# Altium schematic sheet LED.SchDoc
size A3; SheetNumber: 4; SheetTotal: 7
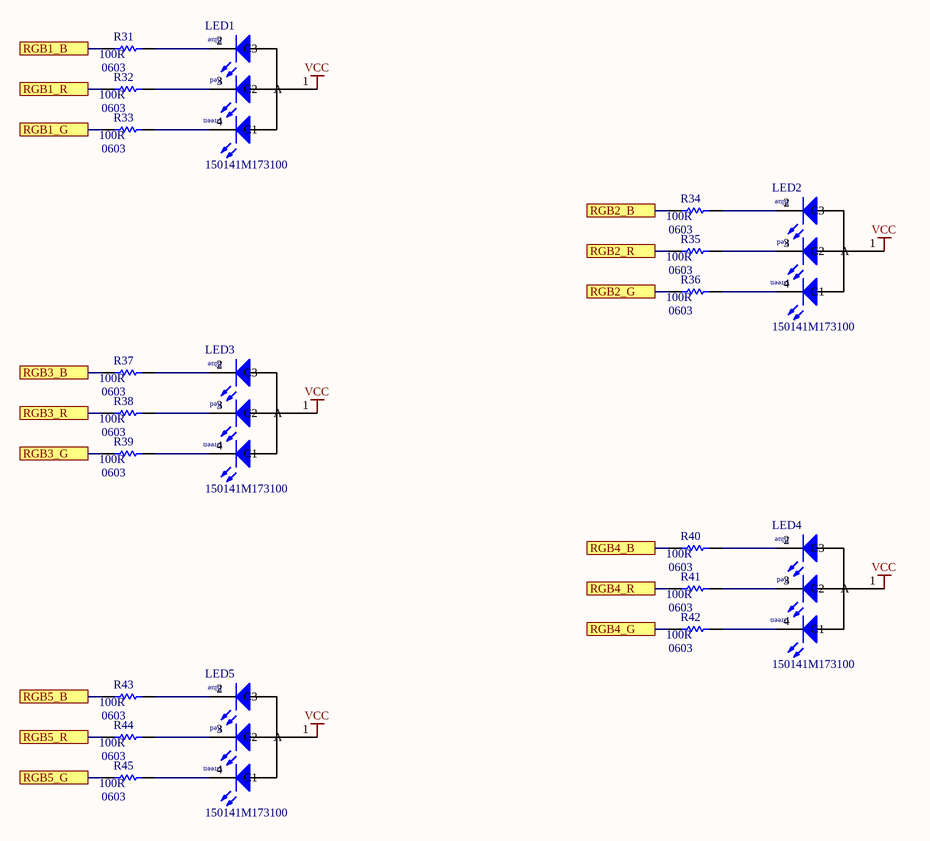
[diagram p0: LED.SchDoc]

## Parts
LED1  150141M173100  [3528_A]
LED2  150141M173100  [3528_A]
LED3  150141M173100  [3528_A]
LED4  150141M173100  [3528_A]
LED5  150141M173100  [3528_A]
R31  Case/Package: 0603  Resistance: 100R  [RESC1608X55X30LL15T15]  (hidden comment: ERJ-3EKF1000V)
R32  Case/Package: 0603  Resistance: 100R  [RESC1608X55X30LL15T15]  (hidden comment: ERJ-3EKF1000V)
R33  Case/Package: 0603  Resistance: 100R  [RESC1608X55X30LL15T15]  (hidden comment: ERJ-3EKF1000V)
R34  Case/Package: 0603  Resistance: 100R  [RESC1608X55X30LL15T15]  (hidden comment: ERJ-3EKF1000V)
R35  Case/Package: 0603  Resistance: 100R  [RESC1608X55X30LL15T15]  (hidden comment: ERJ-3EKF1000V)
R36  Case/Package: 0603  Resistance: 100R  [RESC1608X55X30LL15T15]  (hidden comment: ERJ-3EKF1000V)
R37  Case/Package: 0603  Resistance: 100R  [RESC1608X55X30LL15T15]  (hidden comment: ERJ-3EKF1000V)
R38  Case/Package: 0603  Resistance: 100R  [RESC1608X55X30LL15T15]  (hidden comment: ERJ-3EKF1000V)
R39  Case/Package: 0603  Resistance: 100R  [RESC1608X55X30LL15T15]  (hidden comment: ERJ-3EKF1000V)
R40  Case/Package: 0603  Resistance: 100R  [RESC1608X55X30LL15T15]  (hidden comment: ERJ-3EKF1000V)
R41  Case/Package: 0603  Resistance: 100R  [RESC1608X55X30LL15T15]  (hidden comment: ERJ-3EKF1000V)
R42  Case/Package: 0603  Resistance: 100R  [RESC1608X55X30LL15T15]  (hidden comment: ERJ-3EKF1000V)
R43  Case/Package: 0603  Resistance: 100R  [RESC1608X55X30LL15T15]  (hidden comment: ERJ-3EKF1000V)
R44  Case/Package: 0603  Resistance: 100R  [RESC1608X55X30LL15T15]  (hidden comment: ERJ-3EKF1000V)
R45  Case/Package: 0603  Resistance: 100R  [RESC1608X55X30LL15T15]  (hidden comment: ERJ-3EKF1000V)

## Ports
RGB1_B, RGB1_G, RGB1_R, RGB2_B, RGB2_G, RGB2_R, RGB3_B, RGB3_G, RGB3_R, RGB4_B, RGB4_G, RGB4_R, RGB5_B, RGB5_G, RGB5_R

## Nets
VCC: LED1.1(A) LED2.1(A) LED3.1(A) LED4.1(A) LED5.1(A)
RGB1_B: R31.1 ; port RGB1_B
RGB1_G: R33.1 ; port RGB1_G
RGB1_R: R32.1 ; port RGB1_R
RGB2_B: R34.1 ; port RGB2_B
RGB2_G: R36.1 ; port RGB2_G
RGB2_R: R35.1 ; port RGB2_R
RGB3_B: R37.1 ; port RGB3_B
RGB3_G: R39.1 ; port RGB3_G
RGB3_R: R38.1 ; port RGB3_R
RGB4_B: R40.1 ; port RGB4_B
RGB4_G: R42.1 ; port RGB4_G
RGB4_R: R41.1 ; port RGB4_R
RGB5_B: R43.1 ; port RGB5_B
RGB5_G: R45.1 ; port RGB5_G
RGB5_R: R44.1 ; port RGB5_R
NetLED1_2: LED1.2(C3) R31.2
NetLED1_3: LED1.3(C2) R32.2
NetLED1_4: LED1.4(C1) R33.2
NetLED2_2: LED2.2(C3) R34.2
NetLED2_3: LED2.3(C2) R35.2
NetLED2_4: LED2.4(C1) R36.2
NetLED3_2: LED3.2(C3) R37.2
NetLED3_3: LED3.3(C2) R38.2
NetLED3_4: LED3.4(C1) R39.2
NetLED4_2: LED4.2(C3) R40.2
NetLED4_3: LED4.3(C2) R41.2
NetLED4_4: LED4.4(C1) R42.2
NetLED5_2: LED5.2(C3) R43.2
NetLED5_3: LED5.3(C2) R44.2
NetLED5_4: LED5.4(C1) R45.2

## Notes on the sheet
- (in symbol CMP-1431-00001-1) Blue; Red; Green

## Library data of the parts
LED1-LED5 = CMP-1431-00001-1: SMD Full-Color Top LED, WL-SFTW, Red & Green & Blue; Manufacturer: Wuerth Elektronik; PackageReference: 3528_A; PartNumber: 150141M173100; ComponentLink2Description: Datasheet; ComponentLink1URL: http://www.we-online.com; Color: Red & Green & Blue; ComponentLink1Description: Manufacturer URL; ComponentLink2URL: http://katalog.we-online.com/led/datasheet/150141M173100.pdf
R31-R45 = CMP-2000-00179-1: Manufacturer: Panasonic; Manufacturer Part Number: ERJ3EKF1000V; Tolerance: 1%; Power Rating: 100mW; Voltage Rating: 75V; Temperature Coefficient: 100ppm/°C; Part Number: ERJ-3EKF1000V; Supplier 1: RSComponents; Supplier Part Number 1: 1755733; RoHS: Yes; Category: Chip SMD Resistors; Stock 1: 30000; Pricing 1: 5000=0,01000, 10000=0,00800, 15000=0,00800, 20000=0,00800, 5000=0,00700, 10000=0,00600, 15000=0,00600, 20000=0,00600 (USD); Mount: Surface Mount; Number of Pins: 2; Case Code (Imperial): 0603; Case Code (Metric): 1608; Weight: 7.1E-05oz; Contact Plating: Tin; Size Code: 0603; Min Operating Temperature: -55°C; Max Operating Temperature: 155°C; Packaging: Tape and Reel; Termination: SMD/SMT; Resistor Type: Thick Film; Number of Terminations: 2; Series: ERJ; Package Quantity: 5000; Max Power Dissipation: 100mW; Voltage Rating (DC): 75V; Resistance Tolerance: 1%; Construction: Rectangular; Features: Automotive AEC-Q200; Length: 1.6mm; Width: 0.8mm; Height: 0.45mm; Depth: 0.8mm; Radiation Hardening: No; REACH SVHC: No SVHC; RoHS Compliant: Yes; Military Standard: Not; Lead Free: Lead Free; ComponentLink1URL: https://datasheet.ciiva.com/34303/1987450-34303565.pdf?src-supplier=Jameco; ComponentLink1Description: https://datasheet.ciiva.com/34303/1987450-34303565.pdf?src-supplier=Jameco; ComponentLink2URL: https://datasheet.ciiva.com/7830/aoa0000ce2-7830728.pdf?src-supplier=Element14; ComponentLink2Description: https://datasheet.ciiva.com/7830/aoa0000ce2-7830728.pdf?src-supplier=Element14; ComponentLink3URL: https://datasheet.ciiva.com/46372/1678782-46372726.pdf?src-supplier=Element14; ComponentLink3Description: https://datasheet.ciiva.com/46372/1678782-46372726.pdf?src-supplier=Element14; ComponentLink4URL: https://datasheet.ciiva.com/22667/1678782-22667887.pdf?src-supplier=Element14; ComponentLink4Description: https://datasheet.ciiva.com/22667/1678782-22667887.pdf?src-supplier=Element14; ComponentLink5URL: https://datasheet.ciiva.com/46372/1678782-46372727.pdf?src-supplier=Element14; ComponentLink5Description: https://datasheet.ciiva.com/46372/1678782-46372727.pdf?src-supplier=Element14; ComponentLink6URL: https://datasheet.ciiva.com/24159/aoa0000ce2-24159753.pdf?src-supplier=Mouser; ComponentLink6Description: https://datasheet.ciiva.com/24159/aoa0000ce2-24159753.pdf?src-supplier=Mouser; ComponentLink7URL: https://datasheet.ciiva.com/16762/70260748-16762666.pdf?src-supplier=Allied+Electronics; ComponentLink7Description: https://datasheet.ciiva.com/16762/70260748-16762666.pdf?src-supplier=Allied+Electronics; ComponentLink8URL: https://datasheet.ciiva.com/16765/70260748-16765766.pdf?src-supplier=Allied+Electronics; ComponentLink8Description: https://datasheet.ciiva.com/16765/70260748-16765766.pdf?src-supplier=Allied+Electronics; ComponentLink9URL: https://datasheet.ciiva.com/9186/aoa0000ce2-9186725.pdf?src-supplier=Avnet; ComponentLink9Description: https://datasheet.ciiva.com/9186/aoa0000ce2-9186725.pdf?src-supplier=Avnet; ComponentLink10URL: https://datasheet.ciiva.com/48530/aoa0000ce2-48530986.pdf?src-supplier=Avnet; ComponentLink10Description: https://datasheet.ciiva.com/48530/aoa0000ce2-48530986.pdf?src-supplier=Avnet; ComponentLink11URL: https://datasheet.ciiva.com/30088/aoa0000ce2-30088649.pdf?src-supplier=Onlinecomponents.com; ComponentLink11Description: https://datasheet.ciiva.com/30088/aoa0000ce2-30088649.pdf?src-supplier=Onlinecomponents.com; ComponentLink12URL: https://datasheet.ciiva.com/17207/aoa0000ce2-17207983.pdf?src-supplier=Avnet+Europe; ComponentLink12Description: https://datasheet.ciiva.com/17207/aoa0000ce2-17207983.pdf?src-supplier=Avnet+Europe